# EAGLE design Growlight2 (EAGLE 5.11)

## Sheet 1 of 3
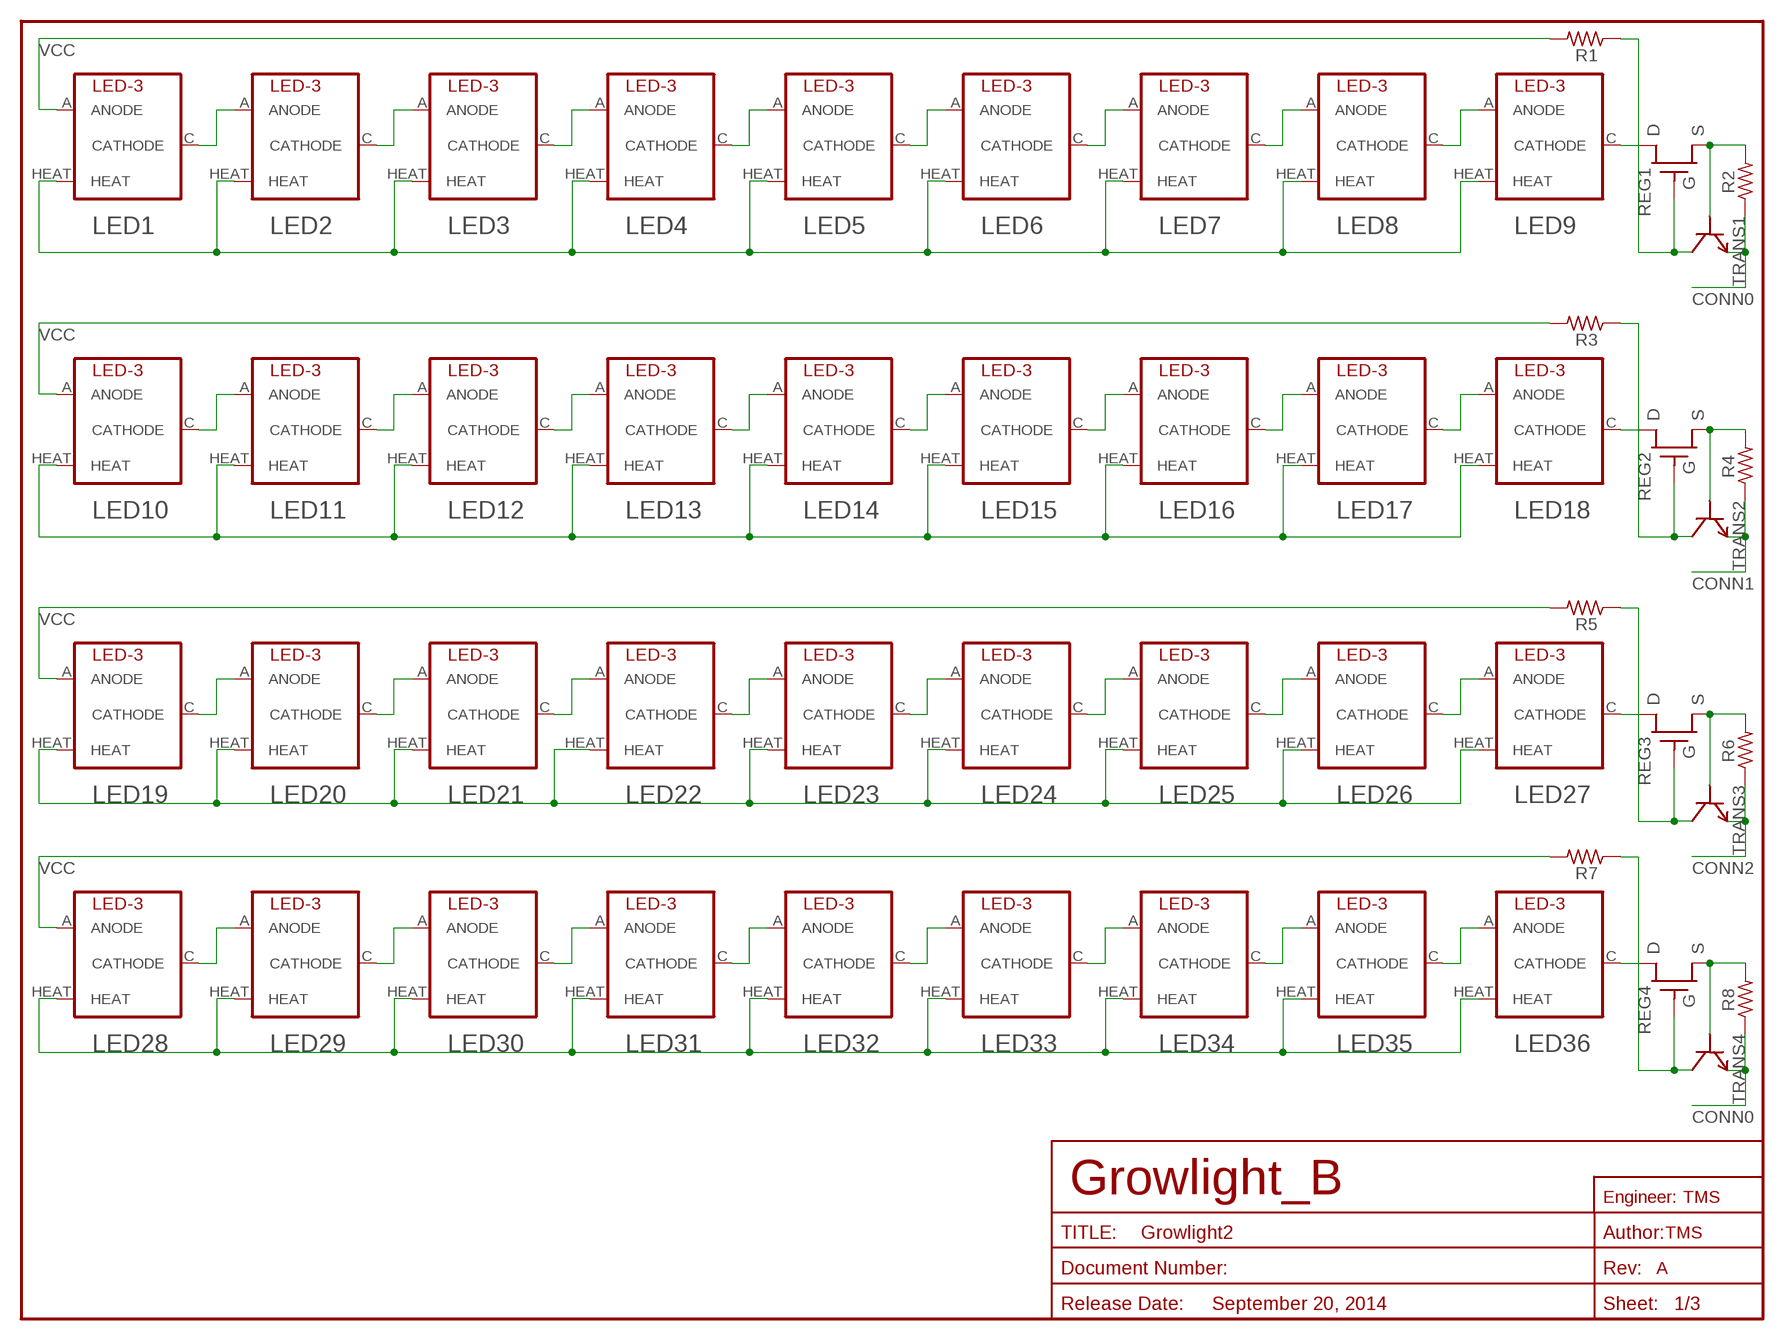
[diagram p0: schematic, sheet 1]

### Parts
LED1  CREE-LED-XPC-XPC  [XPC]
LED2  CREE-LED-XPC-XPC  [XPC]
LED3  CREE-LED-XPC-XPC  [XPC]
LED4  CREE-LED-XPC-XPC  [XPC]
LED5  CREE-LED-XPC-XPC  [XPC]
LED6  CREE-LED-XPC-XPC  [XPC]
LED7  CREE-LED-XPC-XPC  [XPC]
LED8  CREE-LED-XPC-XPC  [XPC]
LED9  CREE-LED-XPC-XPC  [XPC]
LED10  CREE-LED-XPC-XPC  [XPC]
LED11  CREE-LED-XPC-XPC  [XPC]
LED12  CREE-LED-XPC-XPC  [XPC]
LED13  CREE-LED-XPC-XPC  [XPC]
LED14  CREE-LED-XPC-XPC  [XPC]
LED15  CREE-LED-XPC-XPC  [XPC]
LED16  CREE-LED-XPC-XPC  [XPC]
LED17  CREE-LED-XPC-XPC  [XPC]
LED18  CREE-LED-XPC-XPC  [XPC]
LED19  CREE-LED-XPC-XPC  [XPC]
LED20  CREE-LED-XPC-XPC  [XPC]
LED21  CREE-LED-XPC-XPC  [XPC]
LED22  CREE-LED-XPC-XPC  [XPC]
LED23  CREE-LED-XPC-XPC  [XPC]
LED24  CREE-LED-XPC-XPC  [XPC]
LED25  CREE-LED-XPC-XPC  [XPC]
LED26  CREE-LED-XPC-XPC  [XPC]
LED27  CREE-LED-XPC-XPC  [XPC]
LED28  CREE-LED-XPC-XPC  [XPC]
LED29  CREE-LED-XPC-XPC  [XPC]
LED30  CREE-LED-XPC-XPC  [XPC]
LED31  CREE-LED-XPC-XPC  [XPC]
LED32  CREE-LED-XPC-XPC  [XPC]
LED33  CREE-LED-XPC-XPC  [XPC]
LED34  CREE-LED-XPC-XPC  [XPC]
LED35  CREE-LED-XPC-XPC  [XPC]
LED36  CREE-LED-XPC-XPC  [XPC]
R1  RES-1210  [PANASONIC_1210]
R2  RES-S2010  [R2010]
R3  RES-1210  [PANASONIC_1210]
R4  RES-S2010  [R2010]
R5  RES-1210  [PANASONIC_1210]
R6  RES-S2010  [R2010]
R7  RES-1210  [PANASONIC_1210]
R8  RES-S2010  [R2010]
REG1  IRLML2060TRPBFTR-ND  [SOT23]
REG2  IRLML2060TRPBFTR-ND  [SOT23]
REG3  IRLML2060TRPBFTR-ND  [SOT23]
REG4  IRLML2060TRPBFTR-ND  [SOT23]
TRANS1  PMBS3904-NPN  [SOT23]
TRANS2  PMBS3904-NPN  [SOT23]
TRANS3  PMBS3904-NPN  [SOT23]
TRANS4  PMBS3904-NPN  [SOT23]

### Nets
CONN0: R2.1 R8.1 TRANS1.2(E) TRANS4.2(E) ; also sheet 2,3
CONN1: R4.1 TRANS2.2(E) ; also sheet 2,3
CONN2: R6.1 TRANS3.2(E) ; also sheet 2,3
HEAT1: LED1.HEAT LED2.HEAT LED3.HEAT LED4.HEAT LED5.HEAT LED6.HEAT LED7.HEAT LED8.HEAT LED9.HEAT
HEAT2: LED10.HEAT LED11.HEAT LED12.HEAT LED13.HEAT LED14.HEAT LED15.HEAT LED16.HEAT LED17.HEAT LED18.HEAT
HEAT3: LED19.HEAT LED20.HEAT LED21.HEAT LED22.HEAT LED23.HEAT LED24.HEAT LED25.HEAT LED26.HEAT LED27.HEAT
HEAT4: LED28.HEAT LED29.HEAT LED30.HEAT LED31.HEAT LED32.HEAT LED33.HEAT LED34.HEAT LED35.HEAT LED36.HEAT
N$4: R3.P$1 REG2.1(G) TRANS2.3(C)
N$5: R4.2 REG2.2(S) TRANS2.1(B)
N$15: LED10.C(CATHODE) LED11.A(ANODE)
N$16: LED11.C(CATHODE) LED12.A(ANODE)
N$17: LED12.C(CATHODE) LED13.A(ANODE)
N$18: LED13.C(CATHODE) LED14.A(ANODE)
N$19: LED14.C(CATHODE) LED15.A(ANODE)
N$20: LED15.C(CATHODE) LED16.A(ANODE)
N$21: LED16.C(CATHODE) LED17.A(ANODE)
N$22: LED17.C(CATHODE) LED18.A(ANODE)
N$23: LED18.C(CATHODE) REG2.3(D)
N$25: R5.P$1 REG3.1(G) TRANS3.3(C)
N$26: R6.2 REG3.2(S) TRANS3.1(B)
N$27: LED19.C(CATHODE) LED20.A(ANODE)
N$28: LED20.C(CATHODE) LED21.A(ANODE)
N$29: LED21.C(CATHODE) LED22.A(ANODE)
N$30: LED22.C(CATHODE) LED23.A(ANODE)
N$31: LED23.C(CATHODE) LED24.A(ANODE)
N$32: LED24.C(CATHODE) LED25.A(ANODE)
N$33: LED25.C(CATHODE) LED26.A(ANODE)
N$34: LED26.C(CATHODE) LED27.A(ANODE)
N$35: LED27.C(CATHODE) REG3.3(D)
N$37: R7.P$1 REG4.1(G) TRANS4.3(C)
N$38: R8.2 REG4.2(S) TRANS4.1(B)
N$39: LED28.C(CATHODE) LED29.A(ANODE)
N$40: LED29.C(CATHODE) LED30.A(ANODE)
N$41: LED30.C(CATHODE) LED31.A(ANODE)
N$42: LED31.C(CATHODE) LED32.A(ANODE)
N$43: LED32.C(CATHODE) LED33.A(ANODE)
N$44: LED33.C(CATHODE) LED34.A(ANODE)
N$45: LED34.C(CATHODE) LED35.A(ANODE)
N$46: LED35.C(CATHODE) LED36.A(ANODE)
N$47: LED36.C(CATHODE) REG4.3(D)
N$98: R2.2 REG1.2(S) TRANS1.1(B)
N$99: LED1.C(CATHODE) LED2.A(ANODE)
N$100: LED2.C(CATHODE) LED3.A(ANODE)
N$101: LED3.C(CATHODE) LED4.A(ANODE)
N$102: LED4.C(CATHODE) LED5.A(ANODE)
N$103: LED5.C(CATHODE) LED6.A(ANODE)
N$104: LED6.C(CATHODE) LED7.A(ANODE)
N$105: LED7.C(CATHODE) LED8.A(ANODE)
N$106: LED8.C(CATHODE) LED9.A(ANODE)
N$107: LED9.C(CATHODE) REG1.3(D)
REG1: R1.P$1 REG1.1(G) TRANS1.3(C)
VCC: LED1.A(ANODE) LED10.A(ANODE) LED19.A(ANODE) LED28.A(ANODE) R1.P$2 R3.P$2 R5.P$2 R7.P$2 ; also sheet 2,3

### Notes on the sheet
- Growlight_B
- TMS
- TMS
- A
- September 20, 2014

## Sheet 2 of 3
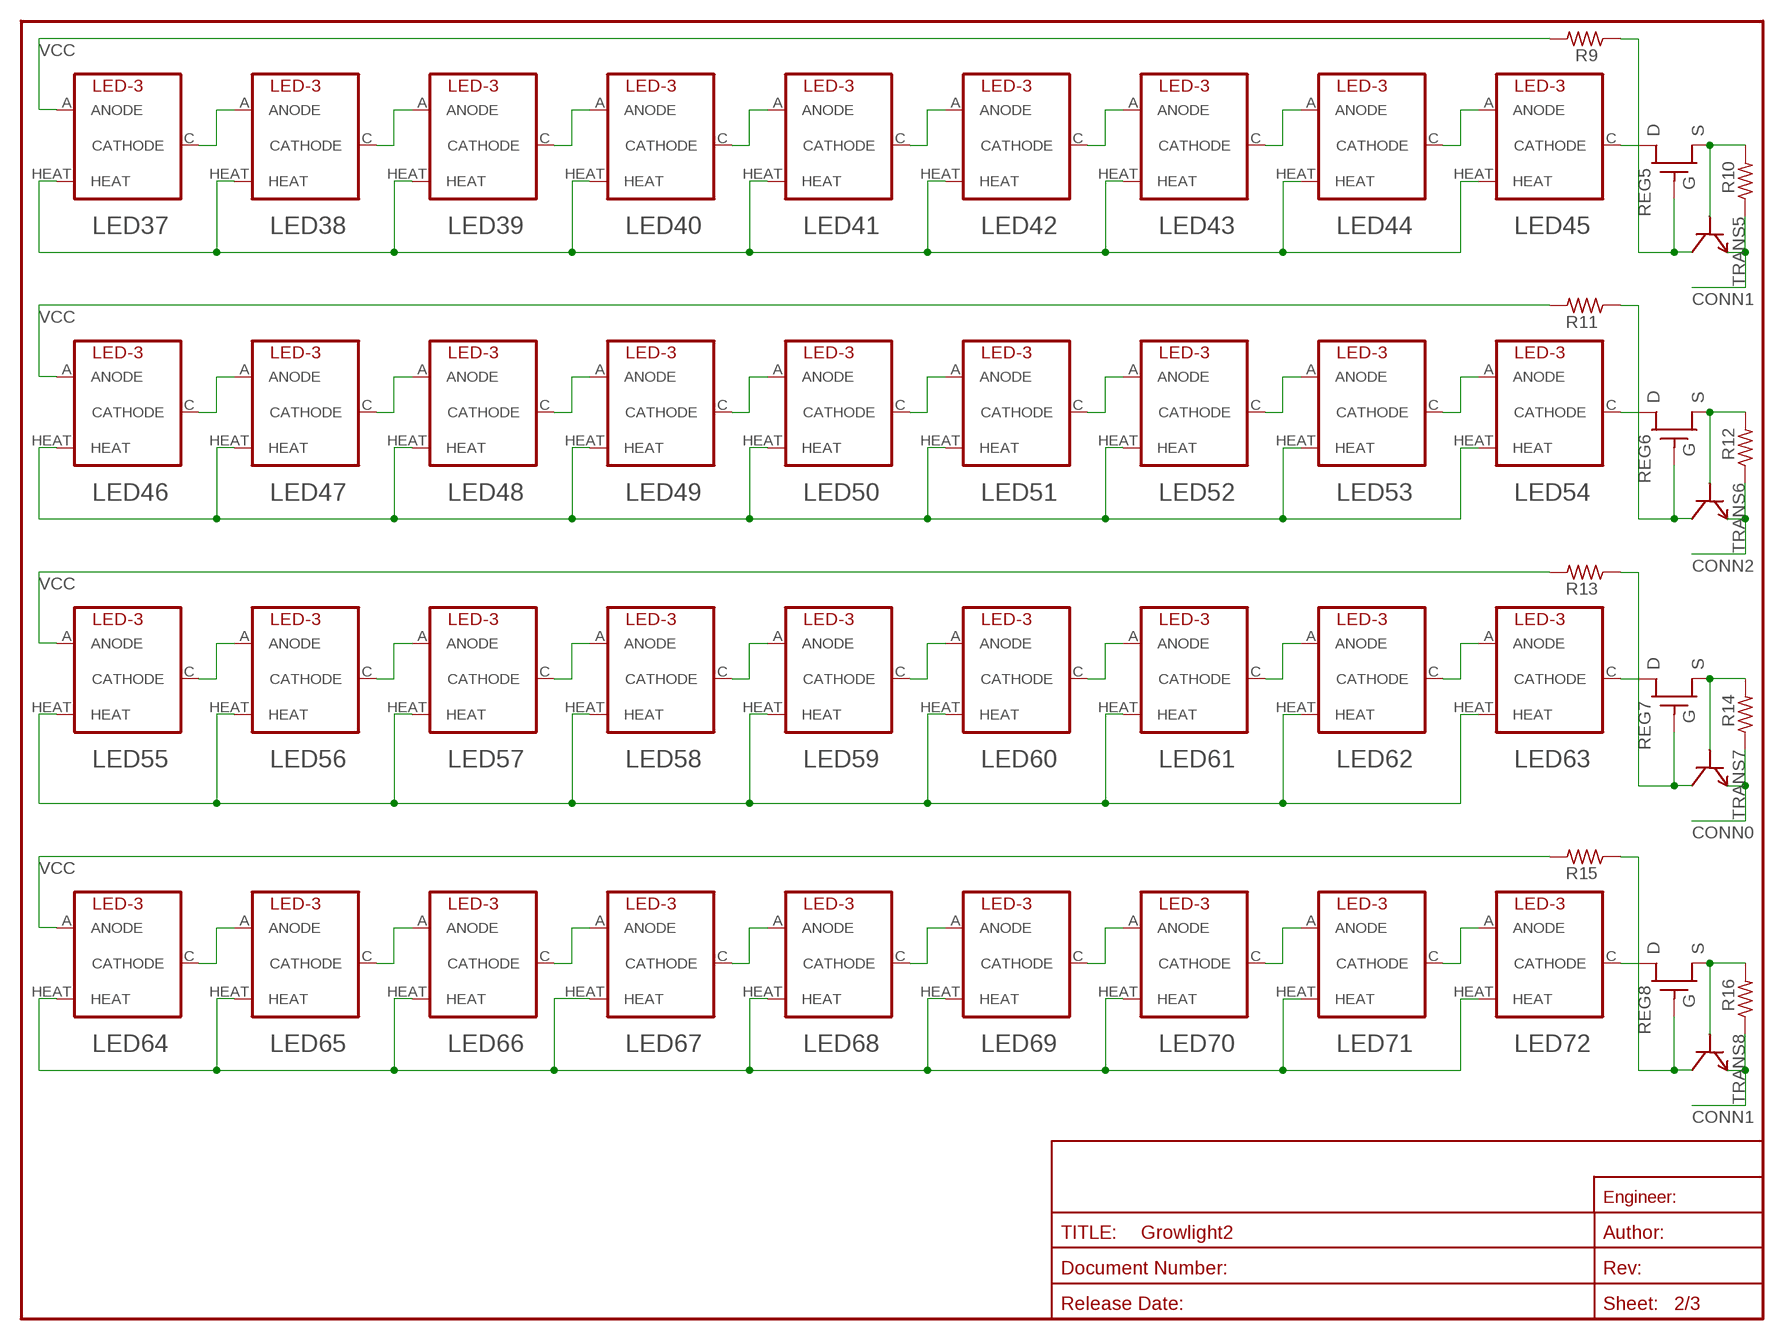
[diagram p1: schematic, sheet 2]

### Parts
LED37  CREE-LED-XPC-XPC  [XPC]
LED38  CREE-LED-XPC-XPC  [XPC]
LED39  CREE-LED-XPC-XPC  [XPC]
LED40  CREE-LED-XPC-XPC  [XPC]
LED41  CREE-LED-XPC-XPC  [XPC]
LED42  CREE-LED-XPC-XPC  [XPC]
LED43  CREE-LED-XPC-XPC  [XPC]
LED44  CREE-LED-XPC-XPC  [XPC]
LED45  CREE-LED-XPC-XPC  [XPC]
LED46  CREE-LED-XPC-XPC  [XPC]
LED47  CREE-LED-XPC-XPC  [XPC]
LED48  CREE-LED-XPC-XPC  [XPC]
LED49  CREE-LED-XPC-XPC  [XPC]
LED50  CREE-LED-XPC-XPC  [XPC]
LED51  CREE-LED-XPC-XPC  [XPC]
LED52  CREE-LED-XPC-XPC  [XPC]
LED53  CREE-LED-XPC-XPC  [XPC]
LED54  CREE-LED-XPC-XPC  [XPC]
LED55  CREE-LED-XPC-XPC  [XPC]
LED56  CREE-LED-XPC-XPC  [XPC]
LED57  CREE-LED-XPC-XPC  [XPC]
LED58  CREE-LED-XPC-XPC  [XPC]
LED59  CREE-LED-XPC-XPC  [XPC]
LED60  CREE-LED-XPC-XPC  [XPC]
LED61  CREE-LED-XPC-XPC  [XPC]
LED62  CREE-LED-XPC-XPC  [XPC]
LED63  CREE-LED-XPC-XPC  [XPC]
LED64  CREE-LED-XPC-XPC  [XPC]
LED65  CREE-LED-XPC-XPC  [XPC]
LED66  CREE-LED-XPC-XPC  [XPC]
LED67  CREE-LED-XPC-XPC  [XPC]
LED68  CREE-LED-XPC-XPC  [XPC]
LED69  CREE-LED-XPC-XPC  [XPC]
LED70  CREE-LED-XPC-XPC  [XPC]
LED71  CREE-LED-XPC-XPC  [XPC]
LED72  CREE-LED-XPC-XPC  [XPC]
R9  RES-1210  [PANASONIC_1210]
R10  RES-S2010  [R2010]
R11  RES-1210  [PANASONIC_1210]
R12  RES-S2010  [R2010]
R13  RES-1210  [PANASONIC_1210]
R14  RES-S2010  [R2010]
R15  RES-1210  [PANASONIC_1210]
R16  RES-S2010  [R2010]
REG5  IRLML2060TRPBFTR-ND  [SOT23]
REG6  IRLML2060TRPBFTR-ND  [SOT23]
REG7  IRLML2060TRPBFTR-ND  [SOT23]
REG8  IRLML2060TRPBFTR-ND  [SOT23]
TRANS5  PMBS3904-NPN  [SOT23]
TRANS6  PMBS3904-NPN  [SOT23]
TRANS7  PMBS3904-NPN  [SOT23]
TRANS8  PMBS3904-NPN  [SOT23]

### Nets
CONN0: R14.1 TRANS7.2(E) ; also sheet 1,3
CONN1: R10.1 R16.1 TRANS5.2(E) TRANS8.2(E) ; also sheet 1,3
CONN2: R12.1 TRANS6.2(E) ; also sheet 1,3
HEAT5: LED37.HEAT LED38.HEAT LED39.HEAT LED40.HEAT LED41.HEAT LED42.HEAT LED43.HEAT LED44.HEAT LED45.HEAT
HEAT6: LED46.HEAT LED47.HEAT LED48.HEAT LED49.HEAT LED50.HEAT LED51.HEAT LED52.HEAT LED53.HEAT LED54.HEAT
HEAT7: LED55.HEAT LED56.HEAT LED57.HEAT LED58.HEAT LED59.HEAT LED60.HEAT LED61.HEAT LED62.HEAT LED63.HEAT
HEAT8: LED64.HEAT LED65.HEAT LED66.HEAT LED67.HEAT LED68.HEAT LED69.HEAT LED70.HEAT LED71.HEAT LED72.HEAT
N$49: R11.P$1 REG6.1(G) TRANS6.3(C)
N$50: R12.2 REG6.2(S) TRANS6.1(B)
N$51: LED46.C(CATHODE) LED47.A(ANODE)
N$52: LED47.C(CATHODE) LED48.A(ANODE)
N$53: LED48.C(CATHODE) LED49.A(ANODE)
N$54: LED49.C(CATHODE) LED50.A(ANODE)
N$55: LED50.C(CATHODE) LED51.A(ANODE)
N$56: LED51.C(CATHODE) LED52.A(ANODE)
N$57: LED52.C(CATHODE) LED53.A(ANODE)
N$58: LED53.C(CATHODE) LED54.A(ANODE)
N$59: LED54.C(CATHODE) REG6.3(D)
N$61: R13.P$1 REG7.1(G) TRANS7.3(C)
N$62: R14.2 REG7.2(S) TRANS7.1(B)
N$63: LED55.C(CATHODE) LED56.A(ANODE)
N$64: LED56.C(CATHODE) LED57.A(ANODE)
N$65: LED57.C(CATHODE) LED58.A(ANODE)
N$66: LED58.C(CATHODE) LED59.A(ANODE)
N$67: LED59.C(CATHODE) LED60.A(ANODE)
N$68: LED60.C(CATHODE) LED61.A(ANODE)
N$69: LED61.C(CATHODE) LED62.A(ANODE)
N$70: LED62.C(CATHODE) LED63.A(ANODE)
N$71: LED63.C(CATHODE) REG7.3(D)
N$73: R15.P$1 REG8.1(G) TRANS8.3(C)
N$74: R16.2 REG8.2(S) TRANS8.1(B)
N$75: LED64.C(CATHODE) LED65.A(ANODE)
N$76: LED65.C(CATHODE) LED66.A(ANODE)
N$77: LED66.C(CATHODE) LED67.A(ANODE)
N$78: LED67.C(CATHODE) LED68.A(ANODE)
N$79: LED68.C(CATHODE) LED69.A(ANODE)
N$80: LED69.C(CATHODE) LED70.A(ANODE)
N$81: LED70.C(CATHODE) LED71.A(ANODE)
N$82: LED71.C(CATHODE) LED72.A(ANODE)
N$83: LED72.C(CATHODE) REG8.3(D)
N$85: R9.P$1 REG5.1(G) TRANS5.3(C)
N$86: R10.2 REG5.2(S) TRANS5.1(B)
N$87: LED37.C(CATHODE) LED38.A(ANODE)
N$88: LED38.C(CATHODE) LED39.A(ANODE)
N$89: LED39.C(CATHODE) LED40.A(ANODE)
N$90: LED40.C(CATHODE) LED41.A(ANODE)
N$91: LED41.C(CATHODE) LED42.A(ANODE)
N$92: LED42.C(CATHODE) LED43.A(ANODE)
N$93: LED43.C(CATHODE) LED44.A(ANODE)
N$94: LED44.C(CATHODE) LED45.A(ANODE)
N$95: LED45.C(CATHODE) REG5.3(D)
VCC: LED37.A(ANODE) LED46.A(ANODE) LED55.A(ANODE) LED64.A(ANODE) R9.P$2 R11.P$2 R13.P$2 R15.P$2 ; also sheet 1,3

## Sheet 3 of 3
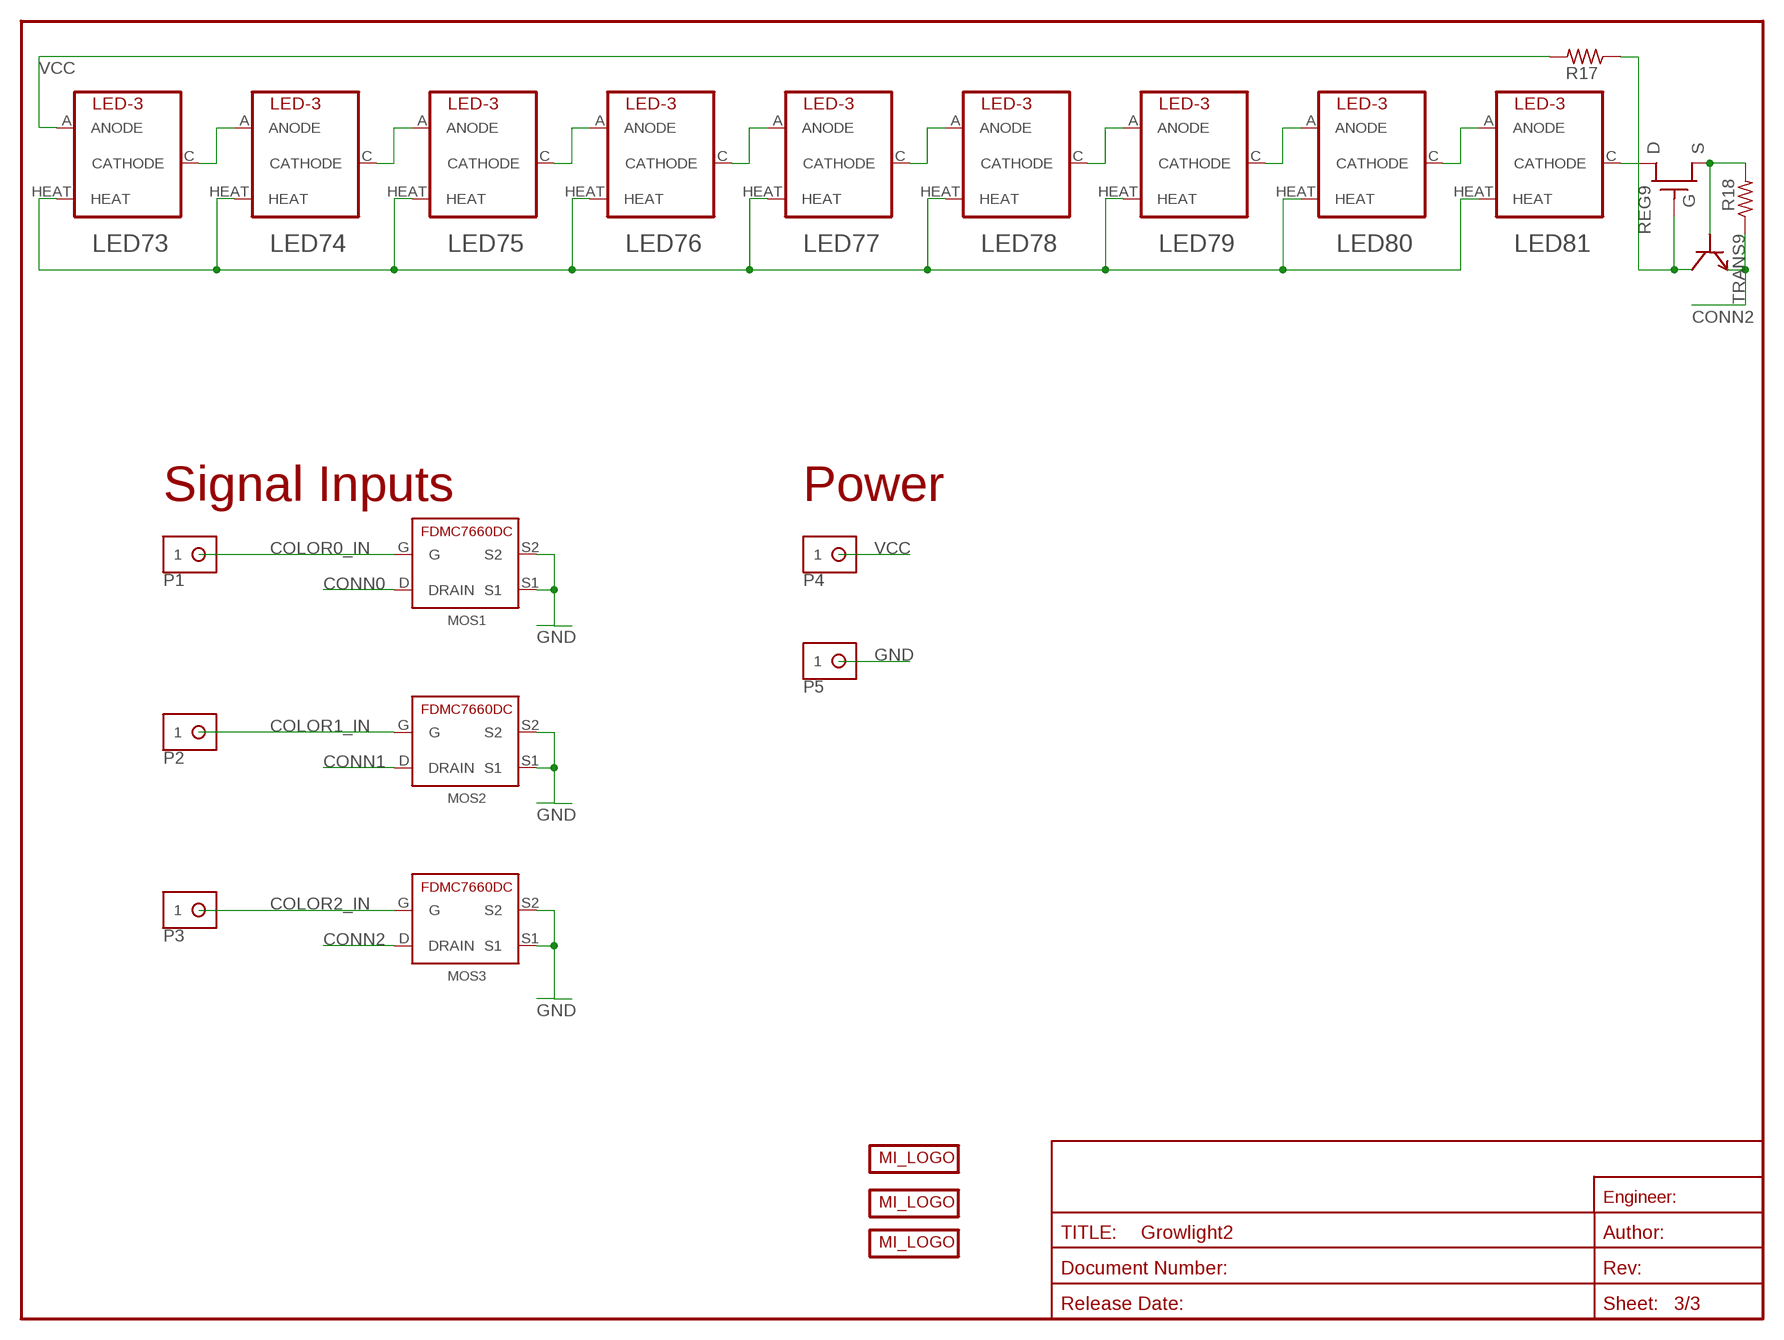
[diagram p2: schematic, sheet 3]

### Parts
LED73  CREE-LED-XPC-XPC  [XPC]
LED74  CREE-LED-XPC-XPC  [XPC]
LED75  CREE-LED-XPC-XPC  [XPC]
LED76  CREE-LED-XPC-XPC  [XPC]
LED77  CREE-LED-XPC-XPC  [XPC]
LED78  CREE-LED-XPC-XPC  [XPC]
LED79  CREE-LED-XPC-XPC  [XPC]
LED80  CREE-LED-XPC-XPC  [XPC]
LED81  CREE-LED-XPC-XPC  [XPC]
MOS1  FDMC7660DC  [FDMC7660DC]
MOS2  FDMC7660DC  [FDMC7660DC]
MOS3  FDMC7660DC  [FDMC7660DC]
P1  PAD-10G  [PAD_10G]
P2  PAD-10G  [PAD_10G]
P3  PAD-10G  [PAD_10G]
P4  PAD-10G  [PAD_10G]
P5  PAD-10G  [PAD_10G]
R17  RES-1210  [PANASONIC_1210]
R18  RES-S2010  [R2010]
REG9  IRLML2060TRPBFTR-ND  [SOT23]
TRANS9  PMBS3904-NPN  [SOT23]
U$1  MI_LOGO-GROVE  [GROVES_LOGO]
U$2  MI_LOGO-2014_USA  [MACRIS_USA_LOGO]
U$3  MI_LOGO-NAME_TWO  [MI_LOGO_NAME_2]

### Nets
COLOR0_IN: MOS1.G P1.1
COLOR1_IN: MOS2.G P2.1
COLOR2_IN: MOS3.G P3.1
CONN0: MOS1.D(DRAIN) ; also sheet 1,2
CONN1: MOS2.D(DRAIN) ; also sheet 1,2
CONN2: MOS3.D(DRAIN) R18.1 TRANS9.2(E) ; also sheet 1,2
GND: MOS1.S1 MOS1.S2 MOS2.S1 MOS2.S2 MOS3.S1 MOS3.S2 P5.1
HEAT9: LED73.HEAT LED74.HEAT LED75.HEAT LED76.HEAT LED77.HEAT LED78.HEAT LED79.HEAT LED80.HEAT LED81.HEAT
N$1: R17.P$1 REG9.1(G) TRANS9.3(C)
N$2: R18.2 REG9.2(S) TRANS9.1(B)
N$6: LED73.C(CATHODE) LED74.A(ANODE)
N$7: LED74.C(CATHODE) LED75.A(ANODE)
N$8: LED75.C(CATHODE) LED76.A(ANODE)
N$9: LED76.C(CATHODE) LED77.A(ANODE)
N$10: LED77.C(CATHODE) LED78.A(ANODE)
N$11: LED78.C(CATHODE) LED79.A(ANODE)
N$12: LED79.C(CATHODE) LED80.A(ANODE)
N$13: LED80.C(CATHODE) LED81.A(ANODE)
N$14: LED81.C(CATHODE) REG9.3(D)
VCC: LED73.A(ANODE) P4.1 R17.P$2 ; also sheet 1,2

### Notes on the sheet
- Signal Inputs | Power

## Library data of the parts
LED1-LED81 = Discrete:CREE-LED-XPC
MOS1-MOS3 = Discrete:FDMC7660DC
P1-P5 = Mechanical:PAD: Solder Pads
R1-R18 = Discrete:RES: Resistor
REG1-REG9 = Discrete:IRLML2060TRPBFTR-ND
TRANS1-TRANS9 = Discrete:PMBS3904: NPN Transistor
U$1-U$3 = Logo:MI_LOGO

## Board
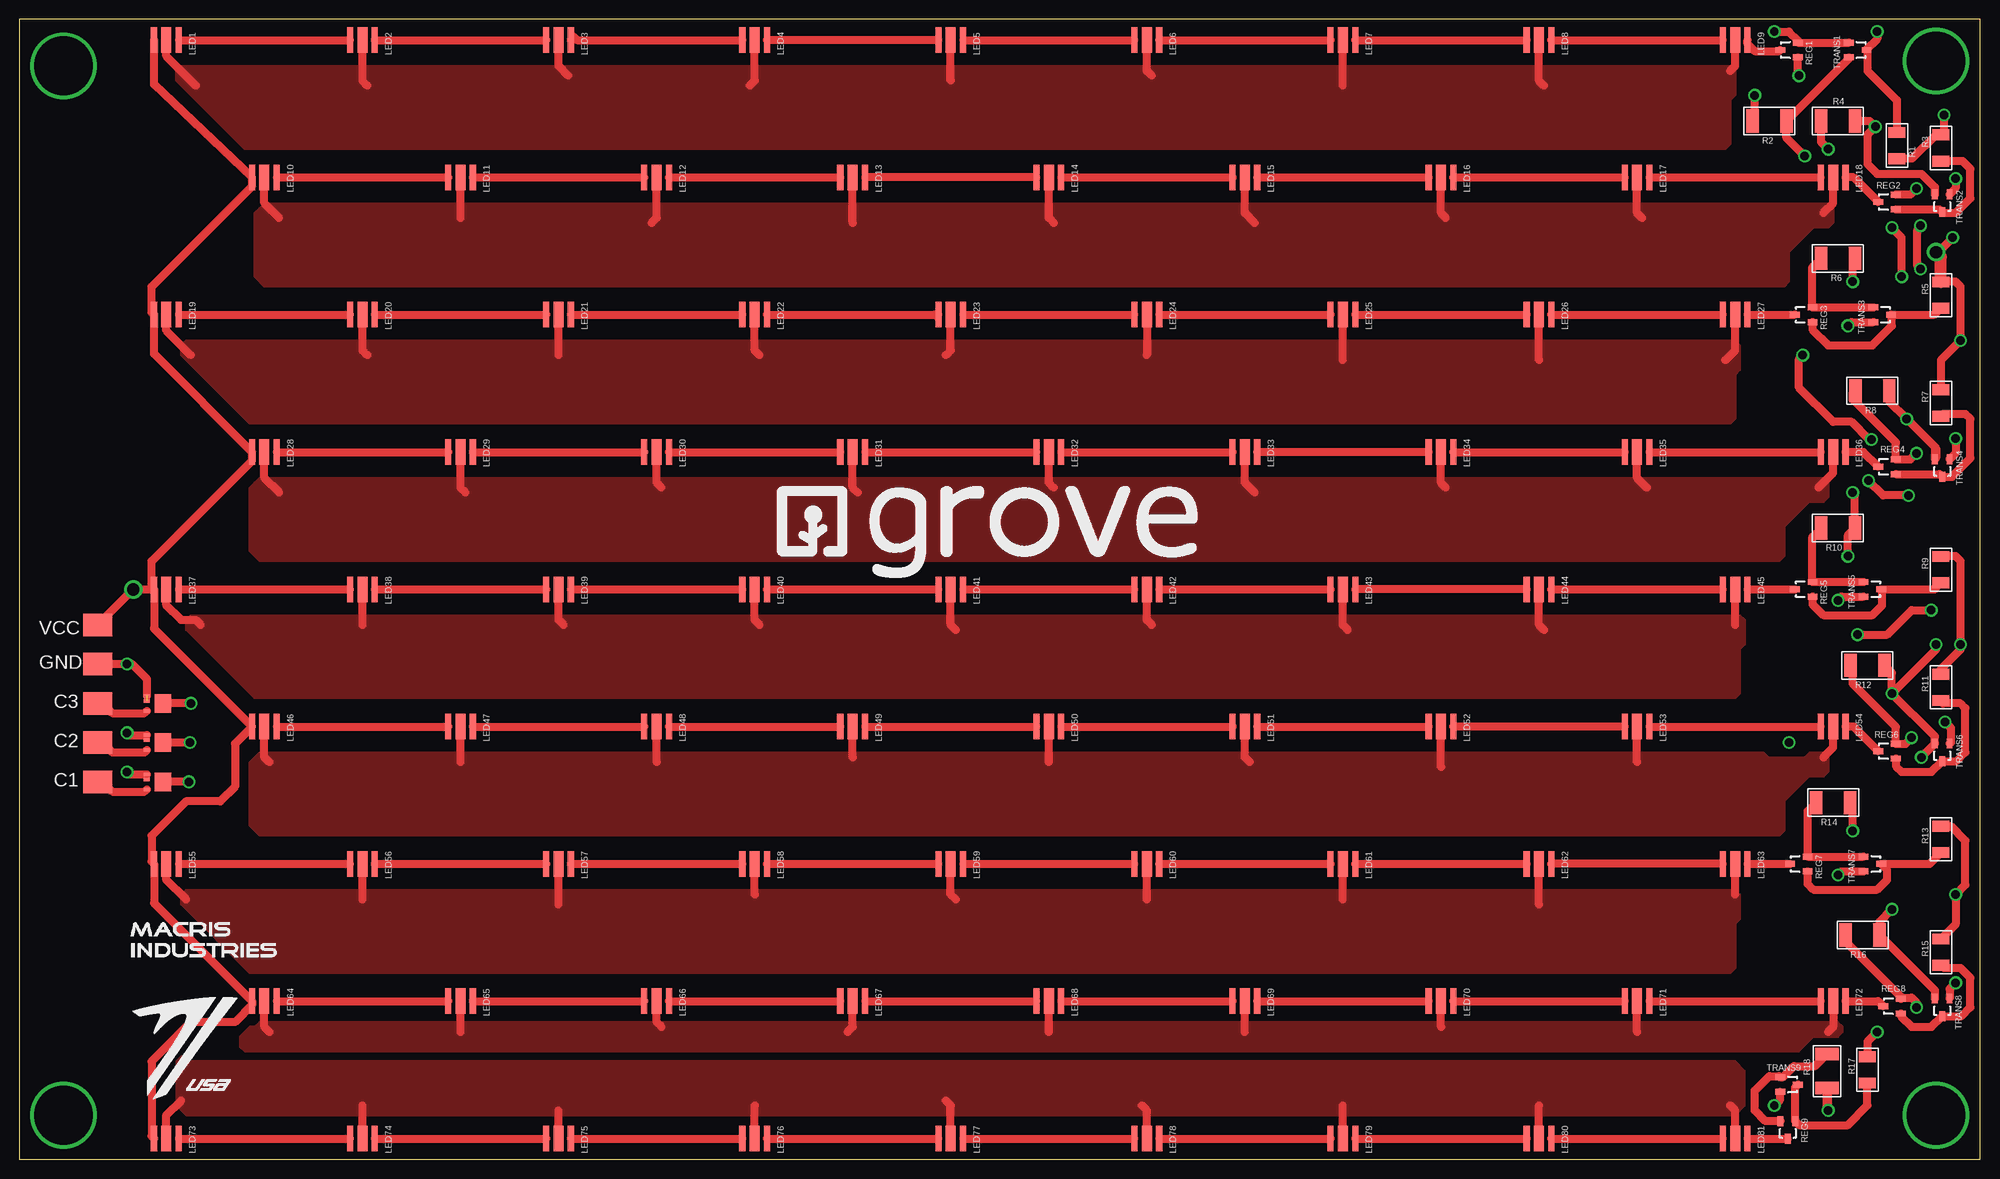
[diagram p3: board, top side]
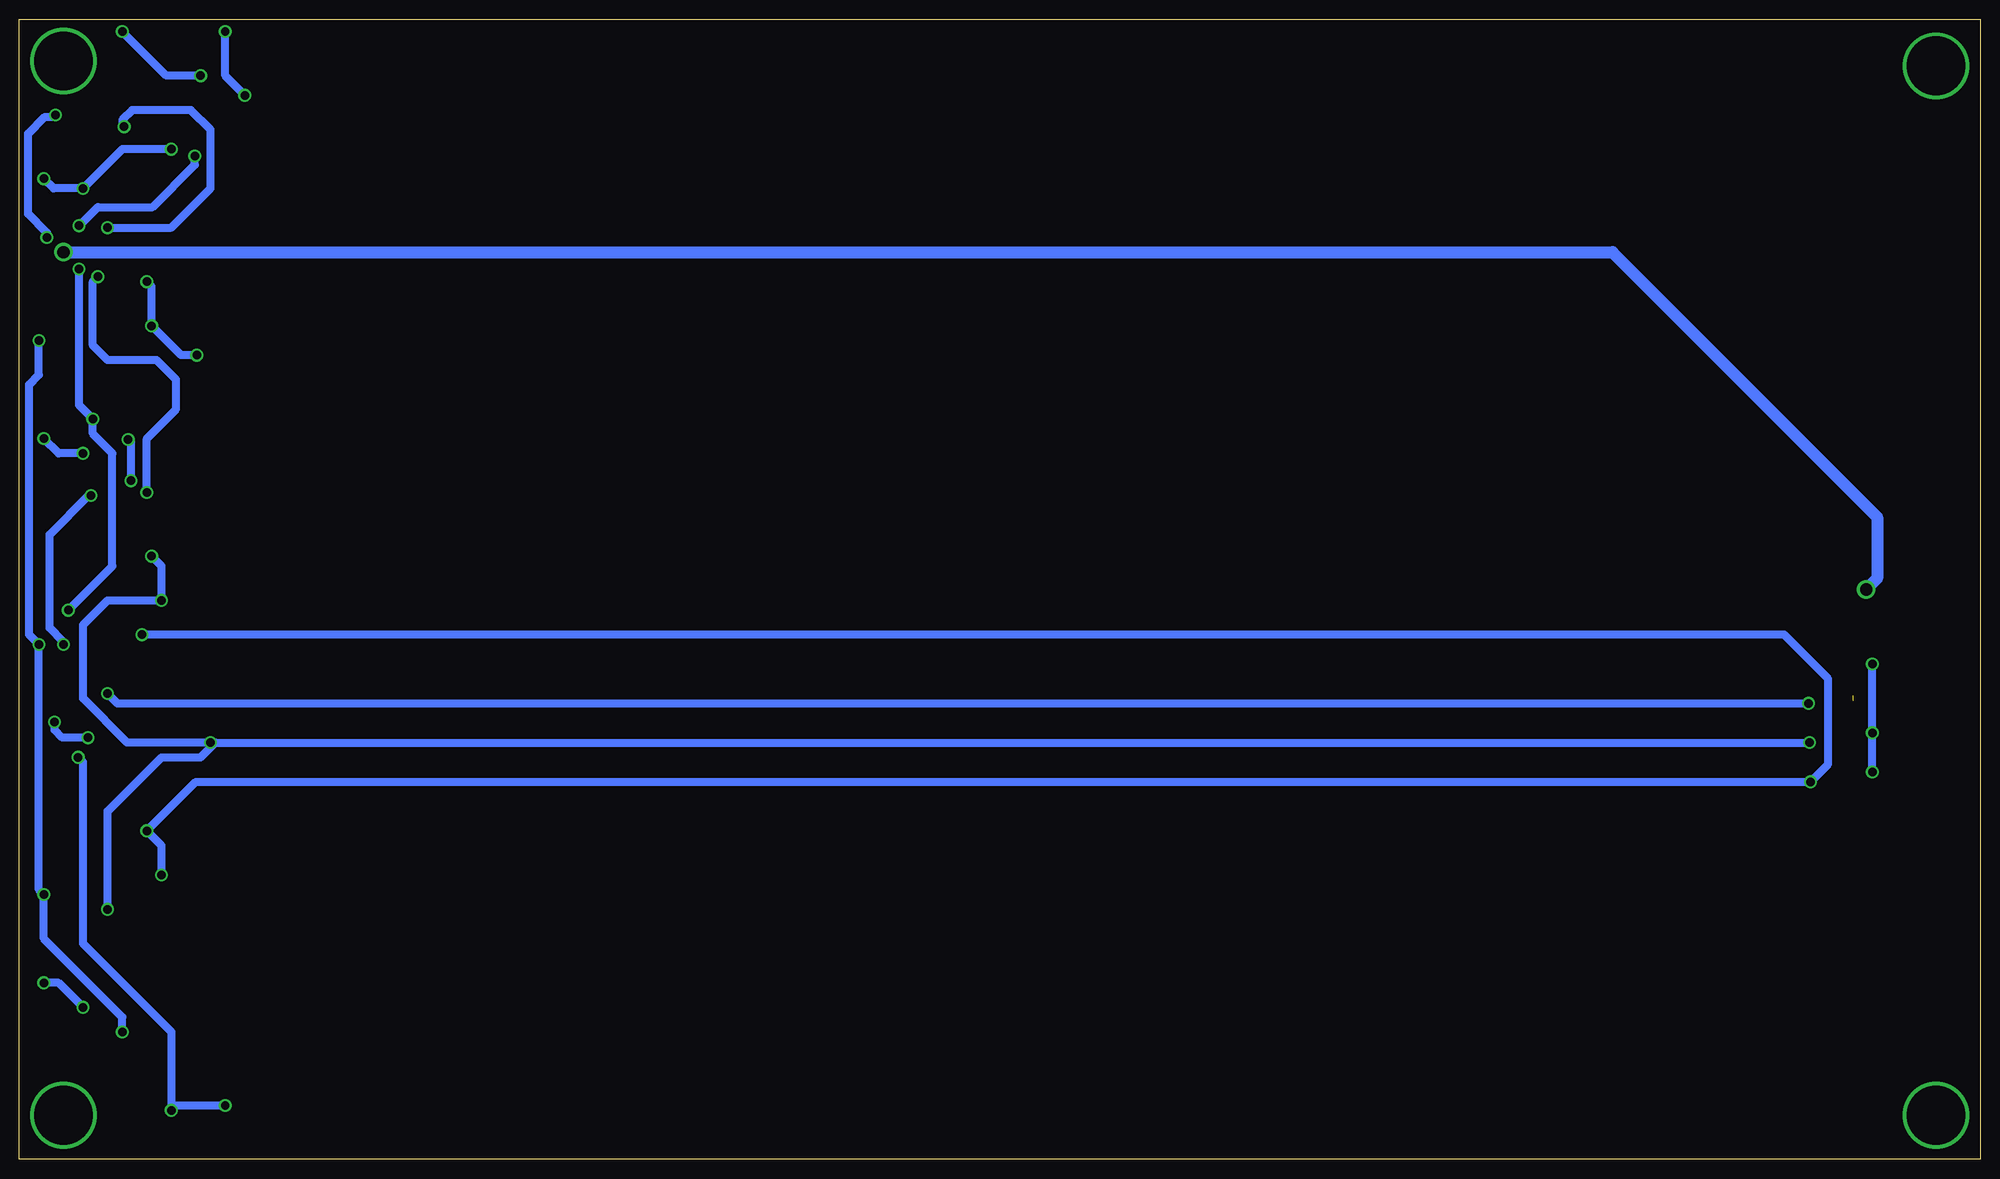
[diagram p4: board, bottom side, seen from below]

Size 254 x 147.64 mm. Coordinates in mm from the lower left corner, seen from the top.
Outline: 0,0 254,0 254,147.64 0,147.64 0,0
Copper layers (1*16): Top 0.0356mm / dielectric 1.5011mm / Bottom 0.0356mm
Design rules "oshPark": minimum track width 6mil, minimum drill 13mil, track to track 6mil, track to pad 6mil, pad to pad 6mil, via to via 6mil, smd to smd 6mil, copper to edge 15mil, drill to drill 6mil, minimum pad ring 7mil, minimum via ring 7mil, stop-mask expansion 4mil, vias tented up to drill 0mil, thermal gap 10mil

### Footprints (pad centres in the part's own frame; a part is rotated, then mirrored left to right if it is on the bottom)
XPC = smd 0.8 x 3.3: A -1.6,0; C 1.6,0 | smd 1.3 x 3.3: HEAT 0,0
FDMC7660DC = smd 2.4 x 2.15: D 0,2.1 | smd 0.45 x 0.75: G 0.975,0; S1 -0.975,0; S2 -0.325,0
PAD_10G = smd 3.81 x 2.921: 1 0,0
PANASONIC_1210 = smd 1.4 x 2.2: P$1 1.7,0; P$2 -1.7,0
R2010 = smd 1.6 x 3: 1 -2.2,0; 2 2.2,0
SOT23 = smd 0.762 x 1.27: 1 -0.953,-1.143; 2 0.953,-1.143; 3 0,1.143

### Placement (x,y rotation side)
LED1  19.05,144.94 0 top
LED2  44.45,144.94 0 top
LED3  69.85,144.94 0 top
LED4  95.25,144.94 0 top
LED5  120.65,144.94 0 top
LED6  146.05,144.94 0 top
LED7  171.45,144.94 0 top
LED8  196.85,144.94 0 top
LED9  222.25,144.94 0 top
LED10  31.75,127.16 0 top
LED11  57.15,127.16 0 top
LED12  82.55,127.16 0 top
LED13  107.95,127.16 0 top
LED14  133.35,127.16 0 top
LED15  158.75,127.16 0 top
LED16  184.15,127.16 0 top
LED17  209.55,127.16 0 top
LED18  234.95,127.16 0 top
LED19  19.05,109.38 0 top
LED20  44.45,109.38 0 top
LED21  69.85,109.38 0 top
LED22  95.25,109.38 0 top
LED23  120.65,109.38 0 top
LED24  146.05,109.38 0 top
LED25  171.45,109.38 0 top
LED26  196.85,109.38 0 top
LED27  222.25,109.38 0 top
LED28  31.75,91.6 0 top
LED29  57.15,91.6 0 top
LED30  82.55,91.6 0 top
LED31  107.95,91.6 0 top
LED32  133.35,91.6 0 top
LED33  158.75,91.6 0 top
LED34  184.15,91.6 0 top
LED35  209.55,91.6 0 top
LED36  234.95,91.6 0 top
LED37  19.05,73.82 0 top
LED38  44.45,73.82 0 top
LED39  69.85,73.82 0 top
LED40  95.25,73.82 0 top
LED41  120.65,73.82 0 top
LED42  146.05,73.82 0 top
LED43  171.45,73.82 0 top
LED44  196.85,73.82 0 top
LED45  222.25,73.82 0 top
LED46  31.75,56.04 0 top
LED47  57.15,56.04 0 top
LED48  82.55,56.04 0 top
LED49  107.95,56.04 0 top
LED50  133.35,56.04 0 top
LED51  158.75,56.04 0 top
LED52  184.15,56.04 0 top
LED53  209.55,56.04 0 top
LED54  234.95,56.04 0 top
LED55  19.05,38.26 0 top
LED56  44.45,38.26 0 top
LED57  69.85,38.26 0 top
LED58  95.25,38.26 0 top
LED59  120.65,38.26 0 top
LED60  146.05,38.26 0 top
LED61  171.45,38.26 0 top
LED62  196.85,38.26 0 top
LED63  222.25,38.26 0 top
LED64  31.75,20.48 0 top
LED65  57.15,20.48 0 top
LED66  82.55,20.48 0 top
LED67  107.95,20.48 0 top
LED68  133.35,20.48 0 top
LED69  158.75,20.48 0 top
LED70  184.15,20.48 0 top
LED71  209.55,20.48 0 top
LED72  234.95,20.48 0 top
LED73  19.05,2.7 0 top
LED74  44.45,2.7 0 top
LED75  69.85,2.7 0 top
LED76  95.25,2.7 0 top
LED77  120.65,2.7 0 top
LED78  146.05,2.7 0 top
LED79  171.45,2.7 0 top
LED80  196.85,2.7 0 top
LED81  222.25,2.7 0 top
MOS1  16.51,48.9 270 top
MOS2  16.51,53.98 270 top
MOS3  16.51,59.05 270 top
P1  10.16,48.9 0 top
P2  10.16,53.98 0 top
P3  10.16,59.05 0 top
P4  10.16,69.22 0 top
P5  10.16,64.14 0 top
R1  243.21,131.29 90 top
R2  226.69,134.46 180 top
R3  248.92,130.97 270 top
R4  235.59,134.46 180 top
R5  248.92,111.92 270 top
R6  235.59,116.68 180 top
R7  248.92,97.95 270 top
R8  240.03,99.54 180 top
R9  248.92,76.36 270 top
R10  235.59,81.76 180 top
R11  248.92,61.12 270 top
R12  239.4,63.98 180 top
R13  248.92,41.43 270 top
R14  234.95,46.2 180 top
R15  248.92,26.83 270 top
R16  238.76,29.05 180 top
R17  239.4,11.59 270 top
R18  234.16,11.43 90 top
REG1  229.24,143.67 90 top
REG2  241.94,123.98 90 top
REG3  231.14,109.38 90 top
REG4  241.94,89.69 90 top
REG5  231.14,73.82 90 top
REG6  241.94,52.86 90 top
REG7  230.5,38.26 90 top
REG8  242.57,19.84 90 top
REG9  229.08,3.81 180 top
TRANS1  238.12,143.67 270 top
TRANS2  249.08,123.83 180 top
TRANS3  241.3,109.38 270 top
TRANS4  249.08,89.53 180 top
TRANS5  240.03,73.82 270 top
TRANS6  249.08,52.7 180 top
TRANS7  240.03,38.26 270 top
TRANS8  249.08,19.68 180 top
TRANS9  229.24,9.68 270 top
U$1  93.6,72.01 0 top
U$2  13.84,6.73 0 top
U$3  14.1,25.91 0 top

### Tracks (layer width: path | path; a pad name or v marks a point on that pad's centre or on a via)
COLOR0_IN
  Top 1.016: P1.1 10.79,48.9 12.06,47.62 16.21,47.62 MOS1.G
COLOR1_IN
  Top 1.016: P2.1 10.79,53.98 12.06,52.7 16.21,52.7 MOS2.G
COLOR2_IN
  Top 1.016: P3.1 10.79,59.05 12.06,57.78 16.21,57.78 MOS3.G
CONN0  (via drill 1.1)
  Top 1.016: v21.97,48.9 MOS1.D | TRANS7.2 236.06,37.31 v235.59,36.83 | v237.49,42.55 237.49,45.86 R14.1 | R8.1 242.23,98.13 v244.47,95.89 248.28,92.08 | 248.28,92.08 248.28,90.84 TRANS4.2 248.13,91.92 248.28,92.08 | TRANS1.2 236.98,142.55 R2.1 228.9,132.29 v231.27,129.92 | v247.65,71.12 245.11,71.12 241.94,67.94 v238.12,67.94 | v246.25,120.9 246.25,120.78 245.87,120.4 245.87,115.7 v246.25,115.32
  Bottom 1.016: v235.59,36.83 235.59,40.64 v237.49,42.55 231.14,48.9 v21.97,48.9 19.68,51.18 19.68,62.23 25.4,67.94 v238.12,67.94 | v247.65,71.12 241.94,76.83 241.94,91.44 244.47,93.98 v244.47,95.89 246.25,97.66 v246.25,115.32 | v231.27,129.92 231.27,128.78 236.73,123.32 243.84,123.32 v246.25,120.9
CONN1  (via drill 1.1)
  Top 1.016: v22.1,53.98 MOS2.D | TRANS8.2 248.13,21.89 R16.1 240.96,30.77 v242.57,32.38 | TRANS5.2 236.06,72.87 v235.59,72.39 | v236.85,78.11 236.85,80.83 R10.1 237.78,86.06 v237.49,86.36 | TRANS2.2 248.13,125.89 246.38,127.64 240.66,127.64 239.4,128.91 239.4,132.72 v240.41,133.73 239.68,134.46 R4.1 | v243.84,114.3 243.84,119.38 v242.57,120.65
  Bottom 1.016: v236.85,78.11 235.59,76.83 v235.59,72.39 242.57,72.39 245.75,69.22 245.75,59.69 240.03,53.98 v229.24,53.98 228.6,53.98 | 228.6,53.98 v22.1,53.98 | v242.57,32.38 242.57,45.09 235.59,52.07 230.5,52.07 228.6,53.98 | v237.49,86.36 237.49,93.34 233.68,97.16 233.68,100.97 236.22,103.5 242.57,103.5 244.47,105.41 244.47,113.67 v243.84,114.3 | v242.57,120.65 234.31,120.65 229.24,125.73 229.24,133.35 231.78,135.89 239.4,135.89 240.66,134.62 240.66,133.99 v240.41,133.73
CONN2  (via drill 1.1)
  Top 1.016: v22.23,59.05 MOS3.D | TRANS9.2 228.09,7.75 v227.33,6.99 | v242.57,60.33 248.13,54.77 TRANS6.2 246.38,52.1 v246.38,52.07 | v242.57,60.33 242.57,63 R12.1 | TRANS3.2 237.33,108.43 v236.85,107.95 | v237.49,113.67 237.49,116.39 R6.1 | v248.28,66.67 248.28,66.04 v242.57,60.33 | v244.73,85.98 241.43,85.98 v239.52,87.88 | v239.9,93.22 239.65,93.22 237.36,95.5 234.95,95.5 230.5,99.95 230.5,103.63 v231.01,104.14 | v234.31,6.35 234.31,9.07 R18.1 234.16,6.51 v234.31,6.35
  Bottom 1.016: v227.33,6.99 233.68,6.99 v234.31,6.35 234.31,16.51 245.75,27.94 245.75,51.44 v246.38,52.07 | v237.49,113.67 236.85,113.03 v236.85,107.95 233.04,104.14 v231.01,104.14 | v22.23,59.05 241.3,59.05 v242.57,60.33 | v248.28,66.67 248.28,67.06 250.06,68.83 250.06,80.9 244.98,85.98 v244.73,85.98 | v239.52,87.88 239.52,92.84 v239.9,93.22
GND  (via drill 1.1)  (1 unrouted)
  Top 0.508: MOS1.S1 MOS1.S2 | MOS2.S1 MOS2.S2
  Top 1.016: P5.1 v13.97,64.14 14.61,64.14 16.51,62.23 MOS3.S1 | MOS2.S1 14.27,54.95 v13.97,55.24 | MOS1.S1 14.27,49.87 v13.97,50.16
  Bottom 1.016: v13.97,64.14 v13.97,55.24 v13.97,50.16
HEAT1
  Top 1.016: LED9.HEAT 222.25,141.6 221.62,140.97 | LED8.HEAT 196.85,139.7 197.49,139.06 | 171.45,139.06 LED7.HEAT | LED6.HEAT 146.05,140.97 146.69,140.34 | 120.65,139.7 LED5.HEAT | LED4.HEAT 95.25,139.7 94.61,139.06 | LED3.HEAT 69.85,141.6 71.12,140.34 | LED2.HEAT 44.45,139.7 45.09,139.06 | LED1.HEAT 19.05,142.88 22.86,139.06
  pour Top: 20.32,140.97 20.95,141.6 221.62,141.6 222.25,140.97 222.25,137.79 221.62,137.16 221.62,131.44 220.98,130.81 29.21,130.81 20.32,139.7
HEAT2
  Top 1.016: LED10.HEAT 31.75,123.83 33.66,121.92 | 57.15,121.92 LED11.HEAT | LED12.HEAT 82.55,121.92 81.92,121.28 | 107.95,121.28 LED13.HEAT | LED14.HEAT 133.35,121.92 133.99,121.28 | LED15.HEAT 158.75,122.56 160.02,121.28 | LED16.HEAT 184.15,122.56 184.78,121.92 | LED17.HEAT 209.55,122.56 210.19,121.92 | LED18.HEAT 234.95,123.83 233.68,122.56
  pour Top: 30.48,122.56 31.11,123.19 31.75,123.83 234.31,123.83 234.95,123.19 234.95,121.28 234.31,120.65 232.41,120.65 229.24,117.47 229.24,113.67 228.6,113.03 31.75,113.03 30.48,114.3
HEAT3
  Top 1.016: LED27.HEAT 222.25,104.78 220.98,103.5 | 196.85,103.5 LED26.HEAT | 171.45,103.5 LED25.HEAT | LED24.HEAT 146.05,104.14 | LED23.HEAT 120.65,104.78 120.02,104.14 | LED22.HEAT 95.25,104.78 95.89,104.14 | 69.85,104.14 LED21.HEAT | LED20.HEAT 44.45,104.78 45.09,104.14 | LED19.HEAT 19.05,107.31 22.23,104.14
  pour Top: 20.95,105.41 21.59,106.05 222.25,106.05 222.88,105.41 222.88,102.23 222.25,101.6 222.25,95.89 221.62,95.25 29.84,95.25 20.95,104.14
HEAT4
  Top 1.016: LED28.HEAT 31.75,88.27 33.66,86.36 | LED29.HEAT 57.15,87 57.78,86.36 | LED30.HEAT 82.55,87.63 83.19,87 | LED31.HEAT 107.95,87 108.58,86.36 | LED32.HEAT 133.35,87.63 133.99,87 | LED33.HEAT 158.75,87.63 160.02,86.36 | LED34.HEAT 184.15,87.63 184.78,87 | LED35.HEAT 209.55,88.27 210.82,87 | LED36.HEAT 234.95,88.9 233.04,87
  pour Top: 29.84,87 30.48,87.63 31.11,88.27 233.68,88.27 234.31,87.63 234.31,85.72 233.68,85.09 231.78,85.09 228.6,81.92 228.6,78.11 227.97,77.47 31.11,77.47 29.84,78.74
HEAT5
  Top 1.016: 222.25,69.22 LED45.HEAT | LED44.HEAT 196.85,69.22 197.49,68.58 | LED43.HEAT 171.45,69.22 172.09,68.58 | LED42.HEAT 146.05,69.85 146.69,69.22 | LED41.HEAT 120.65,69.22 121.28,68.58 | LED40.HEAT 95.25,69.85 95.89,69.22 | LED39.HEAT 69.85,69.85 70.48,69.22 | 44.45,69.22 LED38.HEAT | LED37.HEAT 19.05,71.75 20.95,69.85 22.86,69.85 23.5,69.22
  pour Top: 21.59,69.85 22.23,70.48 222.88,70.48 223.52,69.85 223.52,66.67 222.88,66.04 222.88,60.33 222.25,59.69 30.48,59.69 21.59,68.58
HEAT6
  Top 1.016: LED46.HEAT 31.75,52.07 32.38,51.44 | 57.15,51.44 LED47.HEAT | 82.55,51.44 LED48.HEAT | 107.95,52.07 LED49.HEAT | 133.35,51.44 LED50.HEAT | LED51.HEAT 158.75,52.07 159.38,51.44 | 184.15,50.8 LED52.HEAT | 209.55,51.44 LED53.HEAT | LED54.HEAT 234.95,53.34 233.68,52.07
  pour Top: 29.84,51.44 31.11,52.7 225.93,52.7 226.57,52.07 231.27,52.07 231.9,52.7 233.68,52.7 234.31,52.07 234.31,50.16 233.68,49.53 231.78,49.53 228.6,46.35 228.6,42.55 227.97,41.91 31.11,41.91 29.84,43.18
HEAT7
  Top 1.016: LED55.HEAT 19.05,36.2 21.59,33.66 | 44.45,33.66 LED56.HEAT | 69.85,33.02 LED57.HEAT | 95.25,34.29 LED58.HEAT | LED59.HEAT 120.65,34.29 121.28,33.66 | 146.05,33.66 LED60.HEAT | 171.45,33.66 LED61.HEAT | 196.85,33.02 LED62.HEAT | 222.25,34.29 LED63.HEAT
  pour Top: 20.95,34.29 21.59,34.92 222.25,34.92 222.88,34.29 222.88,31.11 222.25,30.48 222.25,24.77 221.62,24.13 29.84,24.13 20.95,33.02
HEAT8
  Top 1.016: LED64.HEAT 31.75,17.14 32.38,16.51 | 57.15,16.51 LED65.HEAT | LED66.HEAT 82.55,17.78 83.19,17.14 | LED67.HEAT 107.95,17.14 107.31,16.51 | 133.35,16.51 LED68.HEAT | 158.75,16.51 LED69.HEAT | 184.15,17.14 LED70.HEAT | 209.55,16.51 LED71.HEAT | LED72.HEAT 234.95,17.14 234.31,16.51
  pour Top: 30.48,17.14 29.84,17.14 28.57,15.88 28.57,14.61 29.21,13.97 230.5,13.97 232.41,15.88 235.59,15.88 236.22,16.51 236.22,17.14 235.59,17.78 31.11,17.78
HEAT9
  Top 1.016: LED73.HEAT 19.05,5.71 20.95,7.62 | LED74.HEAT 44.45,6.99 | LED75.HEAT 69.85,6.35 | LED76.HEAT 95.25,6.99 | LED77.HEAT 120.65,6.99 120.02,7.62 | LED78.HEAT 146.05,6.35 145.41,6.99 | LED79.HEAT 171.45,6.99 | LED80.HEAT 196.85,6.99 | LED81.HEAT 222.25,6.35 221.62,6.99
  pour Top: 20.32,12.7 20.32,6.99 21.59,5.71 222.25,5.71 223.52,6.99 223.52,11.43 222.25,12.7 22.23,12.7 21.59,13.34 20.95,13.34
N$1
  Top 1.016: TRANS9.3 230.03,9.34 REG9.1 230.54,4.45 236.85,4.45 239.4,6.99 R17.P$1
N$2
  Top 1.016: R18.2 232.59,12.06 229.87,12.06 228.44,10.64 TRANS9.1 227.93,10.79 226.69,10.79 224.79,8.89 224.79,6.35 226.19,4.95 REG9.2
N$4
  Top 1.016: REG2.1 248.73,123.03 TRANS2.3 249.21,122.56 250.82,122.56 252.73,124.46 252.73,128.27 251.73,129.27 R3.P$1
N$5  (via drill 1.1)
  Top 1.016: REG2.2 244.95,124.94 v245.75,125.73 | v250.82,127 250.82,125.76 TRANS2.1 | R4.2 233.38,131.74 v234.31,130.81
  Bottom 1.016: v250.82,127 249.56,125.73 v245.75,125.73 240.66,130.81 v234.31,130.81
N$6
  Top 1.016: LED73.C LED74.A
N$7
  Top 1.016: LED74.C LED75.A
N$8
  Top 1.016: LED75.C LED76.A
N$9
  Top 1.016: LED76.C LED77.A
N$10
  Top 1.016: LED77.C LED78.A
N$11
  Top 1.016: LED78.C LED79.A
N$12
  Top 1.016: LED79.C LED80.A
N$13
  Top 1.016: LED80.C LED81.A
N$14
  Top 1.016: LED81.C 229.04,2.7 REG9.3
N$15
  Top 1.016: LED10.C LED11.A
N$16
  Top 1.016: LED11.C LED12.A
N$17
  Top 1.016: LED12.C LED13.A
N$18
  Top 1.016: LED14.A LED13.C
N$19
  Top 1.016: LED14.C LED15.A
N$20
  Top 1.016: LED15.C LED16.A
N$21
  Top 1.016: LED16.C LED17.A
N$22
  Top 1.016: LED17.C LED18.A
N$23
  Top 1.016: LED18.C 237.62,127.16 REG2.3
N$25
  Top 1.016: REG3.1 232.28,107.44 234.31,105.41 240.03,105.41 242.57,107.95 242.57,109.25 TRANS3.3 248.08,109.38 R5.P$1
N$26
  Top 1.016: R6.2 232.28,115.58 REG3.2 TRANS3.1
N$27
  Top 1.016: LED19.C LED20.A
N$28
  Top 1.016: LED20.C LED21.A
N$29
  Top 1.016: LED21.C LED22.A
N$30
  Top 1.016: LED22.C 118.59,109.38 118.75,109.22 118.89,109.22 LED23.A
N$31
  Top 1.016: LED23.C LED24.A
N$32
  Top 1.016: LED24.C LED25.A
N$33
  Top 1.016: LED25.C LED26.A
N$34
  Top 1.016: LED26.C LED27.A
N$35
  Top 1.016: LED27.C REG3.3
N$37
  Top 1.016: REG4.1 248.73,88.74 TRANS4.3 250.32,88.39 252.73,90.81 252.73,95.89 252.09,96.52 249.19,96.52 R7.P$1
N$38  (via drill 1.1)
  Top 1.016: R8.2 237.49,99.2 237.49,98.42 243.08,92.84 REG4.2 244.95,90.65 v245.75,91.44 | v250.82,93.34 250.82,91.47 TRANS4.1
  Bottom 1.016: v245.75,91.44 248.92,91.44 v250.82,93.34
N$39
  Top 1.016: LED28.C LED29.A
N$40
  Top 1.016: LED29.C LED30.A
N$41
  Top 1.016: LED30.C LED31.A
N$42
  Top 1.016: LED31.C LED32.A
N$43
  Top 1.016: LED32.C LED33.A
N$44
  Top 1.016: LED34.A LED33.C
N$45
  Top 1.016: LED34.C LED35.A
N$46
  Top 1.016: LED35.C LED36.A
N$47
  Top 1.016: LED36.C 238.89,91.6 REG4.3
N$49
  Top 1.016: REG6.1 243.08,50.93 243.84,50.16 247.68,50.16 TRANS6.3 250.95,51.56 252.09,52.7 252.09,58.42 251.46,59.05 249.19,59.05 R11.P$1
N$50  (via drill 1.1)
  Top 1.016: v245.11,54.61 244.32,53.82 REG6.2 243.08,56.01 237.49,61.59 237.49,63.68 R12.2 | TRANS6.1 250.19,54.01 250.19,55.88 v249.43,56.64
  Bottom 1.016: v245.11,54.61 248.41,54.61 249.43,55.63 v249.43,56.64
N$51
  Top 1.016: LED46.C LED47.A
N$52
  Top 1.016: LED47.C LED48.A
N$53
  Top 1.016: LED48.C LED49.A
N$54
  Top 1.016: LED49.C LED50.A
N$55
  Top 1.016: LED50.C LED51.A
N$56
  Top 1.016: LED51.C LED52.A
N$57
  Top 1.016: LED53.A LED52.C
N$58
  Top 1.016: LED53.C LED54.A
N$59
  Top 1.016: LED54.C 237.62,56.04 REG6.3
N$61
  Top 1.016: REG7.1 231.65,35.69 232.41,34.92 240.66,34.92 241.94,36.2 241.94,37.5 TRANS7.3 247.44,38.26 R13.P$1
N$62
  Top 1.016: R14.2 231.65,45.09 REG7.2 TRANS7.1
N$63
  Top 1.016: LED55.C LED56.A
N$64
  Top 1.016: LED56.C LED57.A
N$65
  Top 1.016: LED57.C LED58.A
N$66
  Top 1.016: LED58.C LED59.A
N$67
  Top 1.016: LED59.C LED60.A
N$68
  Top 1.016: LED60.C LED61.A
N$69
  Top 1.016: LED61.C LED62.A
N$70
  Top 1.016: LED63.A LED62.C
N$71
  Top 1.016: LED63.C REG7.3
N$73
  Top 1.016: REG8.1 243.71,18.54 245.11,17.14 247.68,17.14 TRANS8.3 251.59,18.54 252.73,19.68 252.73,23.5 251.46,24.77 249.28,24.77 R15.P$1
N$74  (via drill 1.1)
  Top 1.016: R16.2 236.85,28.76 236.85,27.94 243.71,21.08 REG8.2 243.87,20.95 245.11,20.95 245.75,20.32 v245.75,19.68 | TRANS8.1 250.03,22.07 v250.82,22.86
  Bottom 1.016: v250.82,22.86 248.92,22.86 v245.75,19.68
N$75
  Top 1.016: LED64.C LED65.A
N$76
  Top 1.016: LED65.C LED66.A
N$77
  Top 1.016: LED66.C LED67.A
N$78
  Top 1.016: LED67.C LED68.A
N$79
  Top 1.016: LED68.C LED69.A
N$80
  Top 1.016: LED69.C LED70.A
N$81
  Top 1.016: LED70.C LED71.A
N$82
  Top 1.016: LED71.C LED72.A
N$83
  Top 1.016: LED72.C 240.79,20.48 REG8.3
N$85
  Top 1.016: REG5.1 232.28,71.88 233.68,70.48 240.03,70.48 241.3,71.75 241.3,73.69 TRANS5.3 248.08,73.82 R9.P$1
N$86
  Top 1.016: R10.2 232.28,80.65 REG5.2 TRANS5.1
N$87
  Top 1.016: LED37.C LED38.A
N$88
  Top 1.016: LED38.C LED39.A
N$89
  Top 1.016: LED39.C LED40.A
N$90
  Top 1.016: LED40.C LED41.A
N$91
  Top 1.016: LED41.C LED42.A
N$92
  Top 1.016: LED42.C LED43.A
N$93
  Top 1.016: LED44.A LED43.C
N$94
  Top 1.016: LED44.C LED45.A
N$95
  Top 1.016: LED45.C REG5.3
N$98  (via drill 1.1)
  Top 1.016: TRANS1.1 REG1.2 230.38,144.91 229.24,146.05 v227.33,146.05 | v224.79,137.79 224.79,134.76 R2.2
  Bottom 1.016: v227.33,146.05 227.33,140.34 v224.79,137.79
N$99
  Top 1.016: LED1.C LED2.A
N$100
  Top 1.016: LED2.C LED3.A
N$101
  Top 1.016: LED4.A 72.23,144.94 71.75,145.41 71.75,145.24 LED3.C
N$102
  Top 1.016: LED5.A LED4.C
N$103
  Top 1.016: LED5.C LED6.A
N$104
  Top 1.016: LED6.C LED7.A
N$105
  Top 1.016: LED7.C LED8.A
N$106
  Top 1.016: LED8.C LED9.A
N$107
  Top 1.016: LED9.C 223.85,144.45 224.79,143.51 227.93,143.51 REG1.3
N$109  (via drill 7.62)
  other vias: 248.28,142.24
N$110  (via drill 7.62)
  other vias: 5.71,141.6
N$111  (via drill 7.62)
  other vias: 5.71,5.71
N$112  (via drill 7.62)
  other vias: 248.28,5.71
REG1  (via drill 1.1)
  Top 1.016: R1.P$1 243.21,137.16 239.4,140.97 239.4,143.54 TRANS1.3 240.66,145.07 v240.66,146.05 | REG1.1 230.38,140.46 v230.5,140.34
  Bottom 1.016: v230.5,140.34 234.95,140.34 v240.66,146.05
VCC  (via drill 1.1, 1.6)
  Top 1.016: LED73.A 17.14,3 17.14,12.7 22.23,17.78 27.94,17.78 30.15,19.99 LED64.A 17.45,33.18 LED55.A 17.14,38.56 17.14,41.91 21.59,46.35 26.04,46.35 27.94,48.26 27.94,53.83 LED46.A 17.45,68.74 LED37.A | P4.1 v14.76,73.82 LED37.A | LED1.A 17.45,139.22 LED10.A 30.15,126.03 17.14,113.03 17.14,109.68 LED19.A 17.45,104.3 LED28.A 30.15,90.47 17.14,77.47 17.14,74.12 LED37.A | R1.P$2 245.16,129.59 248.28,132.72 248.87,132.72 R3.P$2 249.3,133.05 v249.3,135.25 | R17.P$2 239.4,15.24 v240.66,16.51 | R15.P$2 250.82,30.43 v250.82,34.29 252.09,35.56 252.09,41.27 250.24,43.13 R13.P$2 | R11.P$2 248.92,63.5 251.46,66.04 v251.46,66.67 251.46,77.47 250.82,78.11 248.97,78.11 R9.P$2 | R7.P$2 248.92,103.5 v251.46,106.05 251.46,113.03 250.82,113.67 248.97,113.67 R5.P$2 | v248.28,117.47 248.54,117.47 v250.44,119.38
  Top 1.524: R5.P$2 248.92,116.84 v248.28,117.47
  Bottom 1.016: v240.66,16.51 240.66,18.41 250.82,28.57 v250.82,34.29 251.46,34.92 v251.46,66.67 252.73,67.94 252.73,100.33 251.46,101.6 v251.46,106.05 | v250.44,119.38 250.44,120.02 252.86,122.43 252.86,132.84 250.7,135 249.56,135 v249.3,135.25
  Bottom 1.524: v248.28,117.47 47.62,117.47 13.34,83.19 13.34,75.25 v14.76,73.82

### Text on the board
tNames: VCC | GND | C3 | C2 | C1
Document: 10" | 5.8125" | Middle of the string LED's on 4.75 or 5.25, .25 off of true center which is 5 | Horizontal spacing is 1", with a .5" offset between strings. Vertical spacing is .7". | Vertical offset to top and bottom of board is .106248"